# Altium project Portable_Logger_Rev1.0.PrjPcb
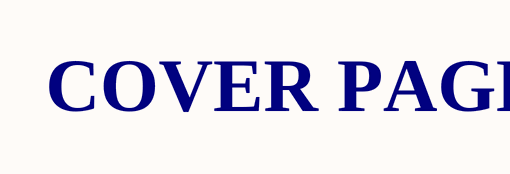
[diagram p0: Cover page - Project Log.SchDoc]
6 sheets, 148 parts. Net scope: flat (ports and power ports of the same name join across sheets).
Board file: Plog_v1.PcbDoc
Sheets:
  Cover page - Project Log.SchDoc
  Block diagram.SchDoc
    Power = 1. Power supply.SchDoc
    MCU = 2. MCU.SchDoc
    GSM = 3.GSM Module.SchDoc
    ADC = 4. ADC.SchDoc

## Sheet Cover page - Project Log.SchDoc
size A

### Notes on the sheet
- COVER PAGE

## Sheet Block diagram.SchDoc
size A
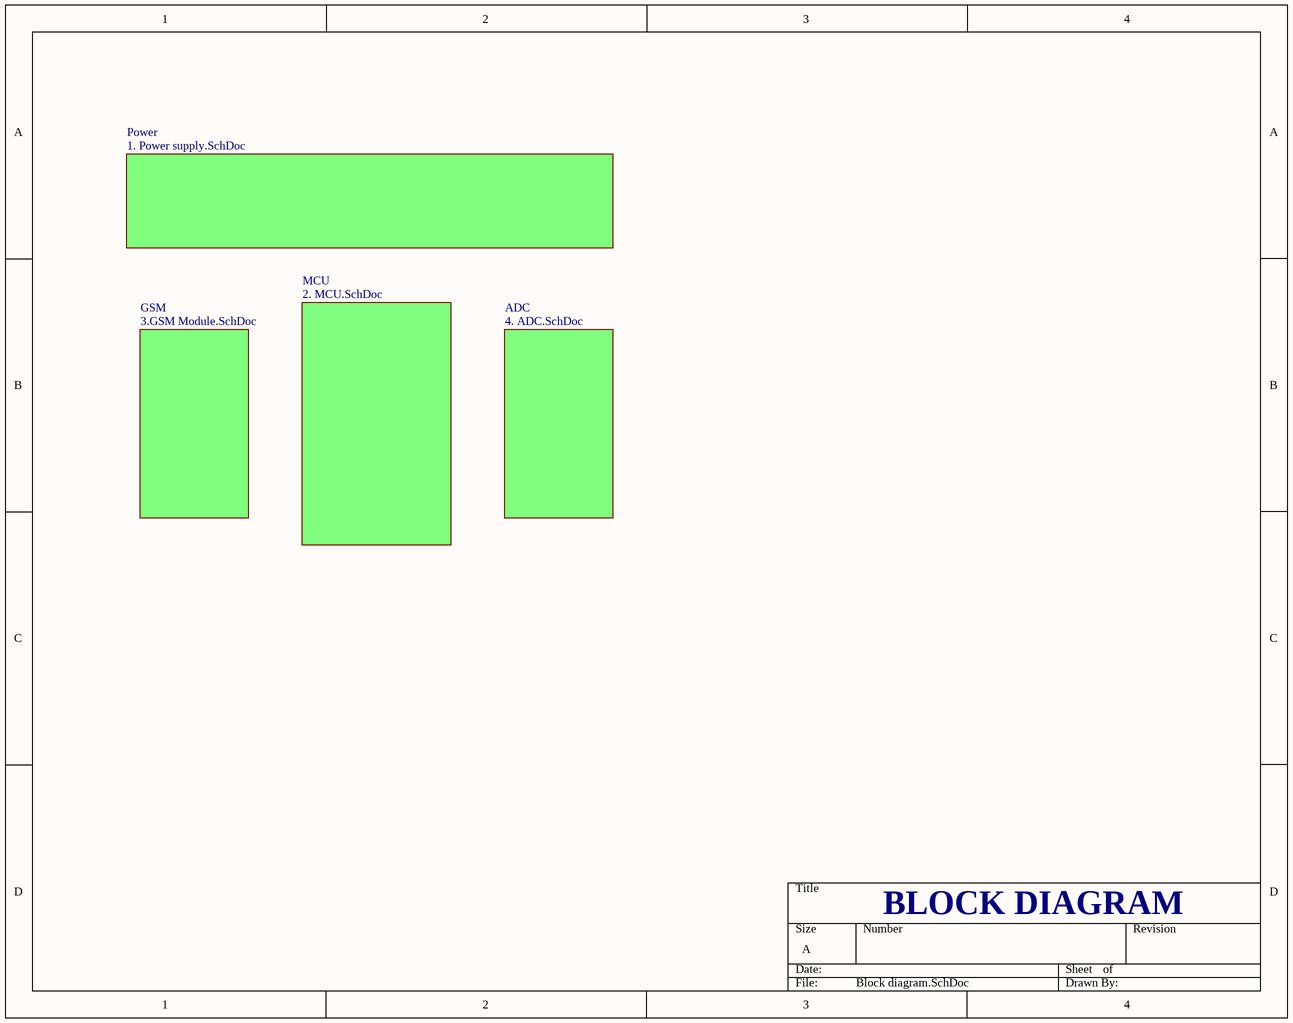
[diagram p1: Block diagram.SchDoc]

### Sub-sheets
ADC = 4. ADC.SchDoc: no entries
GSM = 3.GSM Module.SchDoc: no entries
MCU = 2. MCU.SchDoc: no entries
Power = 1. Power supply.SchDoc: no entries

### Notes on the sheet
- BLOCK DIAGRAM

## Sheet 1. Power supply.SchDoc
size A4
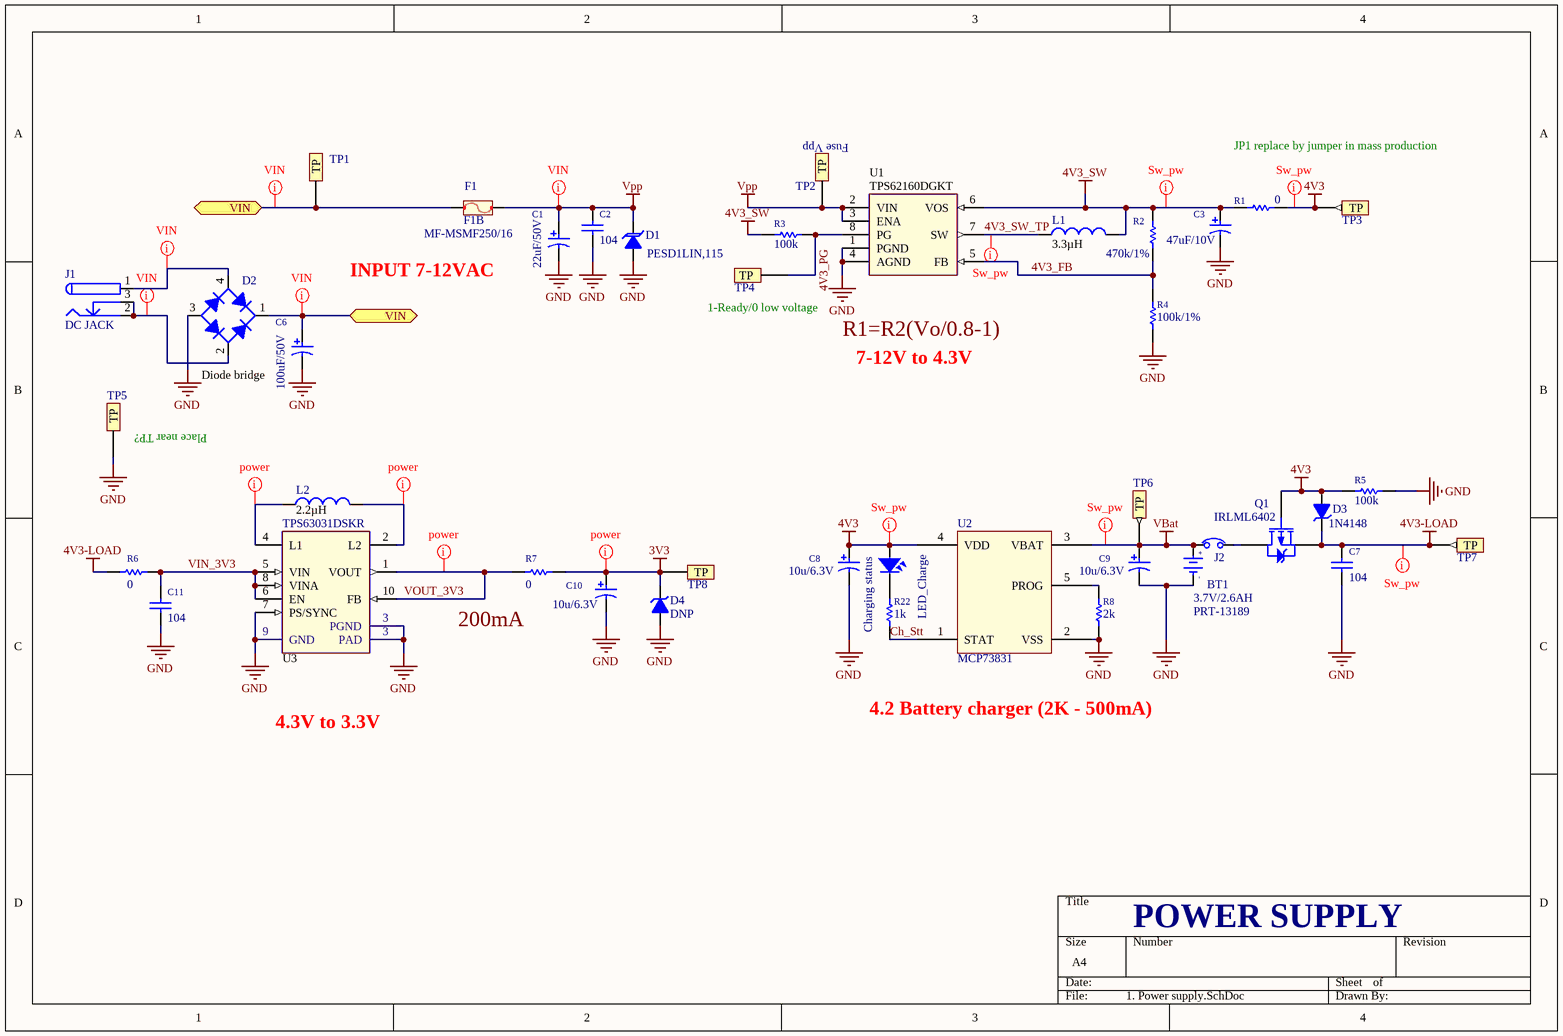
[diagram p2: 1. Power supply.SchDoc]

### Parts
BT1  3.7V/2.6AH  value PRT-13189  [Batterry Cell]
C1  value 22uF/50V  [CAP_SMD_6_3MM_N]  (hidden comment: 22uu/50V)
C2  104  [sm-0603-c]
C3  value 47uF/10V  [Cap SMD Tant - 470u]  (hidden comment: 47uF)
C6  value 100uF/50V  [CAP SMD ALUMINUM G.CAOVANHUONG]  (hidden comment: 22uu/50V)
C7  104  [sm-0603-c]
C8  value 10u/6.3V  [Cap SMD Tant 10u]  (hidden comment: 10u)
C9  value 10u/6.3V  [Cap SMD Tant 10u]  (hidden comment: 10u)
C10  value 10u/6.3V  [Cap SMD Tant 10u]  (hidden comment: 10u)
C11  104  [sm-0603-c]
D1  PESD1LIN,115  [DIODE_SMB]
D2  Diode Bridge  [DB-38R]
D3  1N4148  [DIODE-SOD80]
D4  DNP  [DIODE-SOD80]
F1  F1B  value MF-MSMF250/16  [SMD-PTC]
J1  DC JACK  [DC JACK.CAOVANHUONG]
J2  jumper selector  [CON.HDR1X2]  (value not drawn)
L1  3.3µH  [Inductor 2]
L2  2.2µH  [INDUCTOR 4]
LED_Charge  Charging status  [LED0603]
Q1  IRLML6402  [SOT23-3.CAOVANHUONG]
R1  0  [R2012-0805]
R2  value 470k/1%  [SM-0603-R]  (hidden comment: 470k)
R3  100k  [SM-0603-R]
R4  value 100k/1%  [SM-0603-R]  (hidden comment: 100k)
R5  100k  [SM-0603-R]
R6  0  [R2012-0805]
R7  0  [R2012-0805]
R8  value 2k  [SM-0603-R]  (hidden comment: 100k)
R22  1k  [SM-0603-R]
TP1  Vin  [TP]  (value not drawn)  (no BOM)
TP2  VIN  [TP]  (value not drawn)  (no BOM)
TP3  4V3  [TP]  (value not drawn)  (no BOM)
TP4  4V3_PG  [TP]  (value not drawn)  (no BOM)
TP5  GND  [TP]  (value not drawn)  (no BOM)
TP6  4V3  [TP]  (value not drawn)  (no BOM)
TP7  4V3  [TP]  (value not drawn)  (no BOM)
TP8  TP  [TP]  (value not drawn)  (no BOM)
U1  TPS62160DGKT  [SSOP8.S-PDSO-G8]
U2  MCP73831  [SOT23-5.CAOVANHUONG]
U3  TPS63031DSKR  [WSON10]

### Ports
VIN

### Nets
3V3: C10.1 D4.2(K) R7.2 TP8.1(TP)
4V3: C8.1 D3.1(A) LED_Charge.1 Q1.1(G) R1.2 R5.1 TP3.1(TP) U2.4(VDD)
4V3-LOAD: C7.1 D3.2(K) Q1.2(S) R6.1 TP7.1(TP)
4V3_SW: C3.1 L1.2 R1.1 R2.1 R3.2 U1.6(VOS)
GND: BT1.2(GND) C1.2 C2.2 C3.2 C6.2 C7.2 C8.2 C9.2 C10.2 C11.2 D1.1(A) D2.3(A) D4.1(A) R4.2 R5.2 R8.2 TP5.1(TP) U1.1(PGND) U1.4(AGND) U2.2(VSS) U3.3(PAD) U3.7(PS/SYNC) U3.9(GND)
VBat: BT1.1(+3V) C9.1 J2.1 TP6.1(TP) U2.3(VBAT)
Vpp: C1.1 C2.1 D1.2(K) F1.2 TP2.1(TP) U1.2(VIN) U1.3(ENA)
4V3_FB: R2.2 R4.1 U1.5(FB)
4V3_PG: R3.1 TP4.1(TP) U1.8(PG)
4V3_SW_TP: L1.1 U1.7(SW)
Ch_Stt: R22.1 U2.1(STAT)
VIN_3V3: C11.1 R6.2 U3.5(VIN) U3.6(EN) U3.8(VINA)
VOUT_3V3: R7.1 U3.1(VOUT) U3.10(FB)
NetC6_1: C6.1 D2.1(K) F1.1 TP1.1(TP) ; port VIN
NetD2_2: D2.2(C) J1.2 J1.3
NetD2_4: D2.4(C) J1.1
NetJ2_2: J2.2 Q1.3(D)
NetL2_1: L2.1 U3.4(L1)
NetL2_2: L2.2 U3.2(L2)
NetLED_Charge_2: LED_Charge.2 R22.2
NetR8_1: R8.1 U2.5(PROG)

### Layout directives
rule Width Constraint [Pref Width = 40mil    Min Width = 30mil    Max Width = 50mil]: NetC6_1, NetD2_2, NetD2_4, Vpp
rule Width Constraint [Pref Width = 30mil    Min Width = 10mil    Max Width = 40mil]: 3V3, 4V3, 4V3-LOAD, 4V3_SW, 4V3_SW_TP, NetL2_1, NetL2_2, VBat, VOUT_3V3

### Notes on the sheet
- (near TP2) Fuse Vpp
- JP1 replace by jumper in mass production
- INPUT 7-12VAC
- (near TP4) 1-Ready/0 low voltage
- R1=R2(Vo/0.8-1)
- 7-12V to 4.3V
- (near TP5) Place near TP?
- (near R7) 200mA
- 4.2 Battery charger (2K - 500mA)
- 4.3V to 3.3V
- POWER SUPPLY
- (in symbol PIN 3V) +; -

### Library data of the parts
BT1 = PIN 3V: BATTERY LITHIUM 3.7V 2.6AH; Manufacturer: SparkFun Electronics; Vendor: DIGIKEY; Vendor P/N: 1568-1490-ND; DNP: *; Manufacturer P/N: PRT-13189; Package: 0.72" Dia x 2.56" H; Part: PRT-13189; Price: *
C1 C6 = Cap_Pol: CAP ALUM 22UF 20% 50V SMD; Manufacturer: Panasonic Electronic Components; Manufacturer P/N: EEE-FK1H220P; Part: 22uuF; Vendor: DIGIKEY; Vendor P/N: PCE3811CT-ND; Type: Aluminum Solid/Tantalum Capacitor; Voltage: 50V; Tolerence: 20%
C2 C7 C11 = Capacitor: CAP CER 10000PF 16V 0603; Manufacturer: Taiyo Yuden; Manufacturer P/N: EMK107SD103JA-T; Vendor: DIGIKEY; Vendor P/N: 587-1093-1-ND; Package: 0603; Part: EMK107SD103JA-T; Value: 104; Voltage: 16V
C3 = Cap_Pol: 47uF/10V ±10% SMD Tantalum Capacitor; Manufacturer: AVX; Manufacturer P/N: TAJC476K010RNJ; Voltage: 10V; Type: Aluminum Solid/Tantalum Capacitor; Vendor: www.tme.vn; Vendor P/N: TAJC476K010RNJ; Price: 1600 VND; Part: 47uF; Package: 0603
C8-C10 = Cap_Pol: CAP CER 10UF 6.3V X5R 1206; Manufacturer: Samsung Electro-Mechanics; Manufacturer P/N: CL31A106MQHNNNE; Vendor: DIGIKEY; Vendor P/N: 1276-3045-1-ND; Tollerance: 20%; Voltage: 6.3V; Part: 10u; Package: 1206; DNP: *
D1 = Diode TVS: TVS DIODE 15V/24V 44V/70V SOD323; Manufacturer: Nexperia USA Inc.; Power: 160W; Vendor: DIGIKEY; Vendor P/N: 1727-3818-1-ND; Voltage: 15V; Current: 3A; DNP: *; Manufacturer P/N: PESD1LIN,115; Package: SOD323; Part: PESD1LIN,115; Price: *; Tollerance: *; Value: PESD1LIN,115
D2 = Diode_Bridge: Rectifier Bridge; Vendor: Digikey; Published: 8-Jun-2000; LatestRevisionDate: 17-Jul-2002; LatestRevisionNote: Re-released for DXP Platform.; PackageReference: D-38; ComponentLink1Description: Digikey Part Link; ComponentLink1URL: http://www.irf.com/; ComponentLink2Description: Open Datasheet; ComponentLink2URL: http://www.irf.com/product-info/datasheets/data/1kab-e.pdf; Price: 2000 VND; Date of Price: 19/11/2010; Part: Diode_Bridge; VALUE: Diode bridge
D3 D4 = Diode Zener: Zener Diode; Manufacturer: Unknow; Value: Unknow; DNP: DNP; Manufacturer P/N: Unknow; Package: Unknow; Part: Unknow; Price: Unknow; Vendor: Unknow; Vendor P/N: Unknow; Voltage: Unknow; Current: Unknow
F1 = Fuse: 2.5A/16V SMD-1812 PTC Resettable Fuses; Manufacturer: Bourns Inc.; DNP: *; Manufacturer P/N: MF-MSMF250/16; Package: 1812; Part: MF-MSMF250/16; Vendor: www.tme.vn; Vendor P/N: MF-MSMF250/16; Price: *
J1 = DC JACK: Low Voltage Power Supply Connector; Published: 17-Dec-2003; DatasheetDocument: 09-May-2002; Publisher: Altium Limited; ComponentLink1Description: Manufacturer Link; ComponentLink1URL: http://domino.kycon.com/internet/Products.html
L1 = Inductor: FIXED IND 3.3UH 3.2A 30.2 MOHM; Manufacturer: Bourns Inc.; Manufacturer P/N: SRN6045-3R3Y; Vendor: DIGIKEY; Vendor P/N: SRN6045-3R3YCT-ND; Tollerance: 30%; Part: 3.3µH; Value: 3.3µH; Package: 6.00mm x 6.00mm; Current: 3.2A; Res: 30.2 mOhm
L2 = Inductor: FIXED IND 2.2UH 2.9A 42 MOHM SMD; Manufacturer: Taiyo Yuden; Manufacturer P/N: NRS5020T2R2NMGJ; Vendor: DIGIKEY; Vendor P/N: 587-2405-1-ND; Tollerance: 30%; Res: 42 mOhm; Part: 2.2µH; Value: 2.2µH; Package: 4.90mm x 4.90mm; Current: 2.9A
LED_Charge = LED: LED Single colour Green and Red; Manufacturer: Unknow; Value: LED 3 ly Single Colour; DNP: DNP; Manufacturer P/N: Unknow; Package: Unknow; Part: Unknow; Price: Unknow; Voltage: Unknow; Vendor: Unknow; Vendor P/N: Unknow; Current: Unknow
Q1 = IRLML6402: P-Channel MOSFET, ID =3.7A @ TA = 25°C, VGS @ -4.5V; Published: 8-Jun-2000; LatestRevisionDate: 17-Jul-2002; LatestRevisionNote: Re-released for DXP Platform.; PackageVersion: 1995/1996; PackageReference: E3; Publisher: Altium Limited; PackageDescription: TO, Flat Index; 3 In-Line, Axial Leads; Body Dia. 4.6mm; Lead Dia. 0.5 mm (max)
R1 R6 R7 = Resistor: RES SMD 0 OHM JUMPER 1/10W 0805; Manufacturer: Panasonic Electronic Components; Manufacturer P/N: ERJ-6GEY0R00V; Vendor: DIGIKEY; Vendor P/N: P0.0ACT-ND; Tollerance: 5%; Part: 0; Value: 0; Package: 0805; Power: 1/10W
R2 = Resistor: RES SMD 470K OHM 1% 1/10W 0603; Manufacturer: Panasonic Electronic Components; Manufacturer P/N: ERJ-3EKF4703V; Vendor: DIGIKEY; Vendor P/N: P470KHCT-ND; Tollerance: 1%; Part: 470k; Package: 0603; Power: 1/10W; DNP: *
R3 R5 R8 = Resistor: RES SMD 100K OHM 5% 1/10W 0603; Manufacturer: Panasonic Electronic Components; Manufacturer P/N: ERJ-3GEYJ104V; Vendor: DIGIKEY; Vendor P/N: P100KGCT-ND; Tollerance: 5%; Part: 100k; Package: 0603; Power: 1/10W; DNP: *
  R3 R5: Value: 100k
R4 = Resistor: RES SMD 100K OHM 1% 1/10W 0603; Manufacturer: Panasonic Electronic Components; Manufacturer P/N: ERJ-3EKF1003V; Vendor: DIGIKEY; Vendor P/N: P100KHCT-ND; Tollerance: 1%; Part: 100k; Package: 0603; Power: 1/10W; DNP: *
R22 = Resistor: RES SMD 1K OHM 5% 1/10W 0603; Manufacturer: Panasonic Electronic Components; Manufacturer P/N: ERJ-3GEYJ102V; Vendor: DIGIKEY; Vendor P/N: P1.0KGCT-ND; Tollerance: 5%; Part: 1k; Value: 1k; Package: 0603; Power: 1/10W; DNP: *
TP1-TP8 = TP: Test Point
U1 = TPS62160: IC REG BUCK ADJ 1A SYNC 8VSSOP; Manufacturer: Texas Instruments; Vendor: DIGIKEY; Vendor P/N: 296-30318-1-ND; Value: TPS62160DGKT; Part: TPS62160DGKT; DNP: *; Manufacturer P/N: TPS62160DGKT; Package: VSSOP8
U2 = MCP73831: Miniature Single Cell, Fully Integrated Li-Ion,  Li-Polymer Charge Management ControllerController; Manufacturer: Microchip; Vendor: TME; Vendor P/N: MCP73832T-2ACI/OT; Package: SOT-23-5; Part: MCP73831; Price: 15.000d
U3 = TPS63031: IC REG BUCK BST 3.3V 0.9A 10SON; Manufacturer: Texas Instruments; Vendor: DIGIKEY; Vendor P/N: 296-39461-1-ND; Value: TPS63031DSKR; Part: TPS63031DSKR; DNP: *; Manufacturer P/N: TPS63031DSKR; Package: SON10
J2 = jumper selector: ComponentLink2Description: Open Datasheet; Price: 500 VND; Date of Price: 19/11/2010; Part: jumper selector

## Sheet 2. MCU.SchDoc
size A4
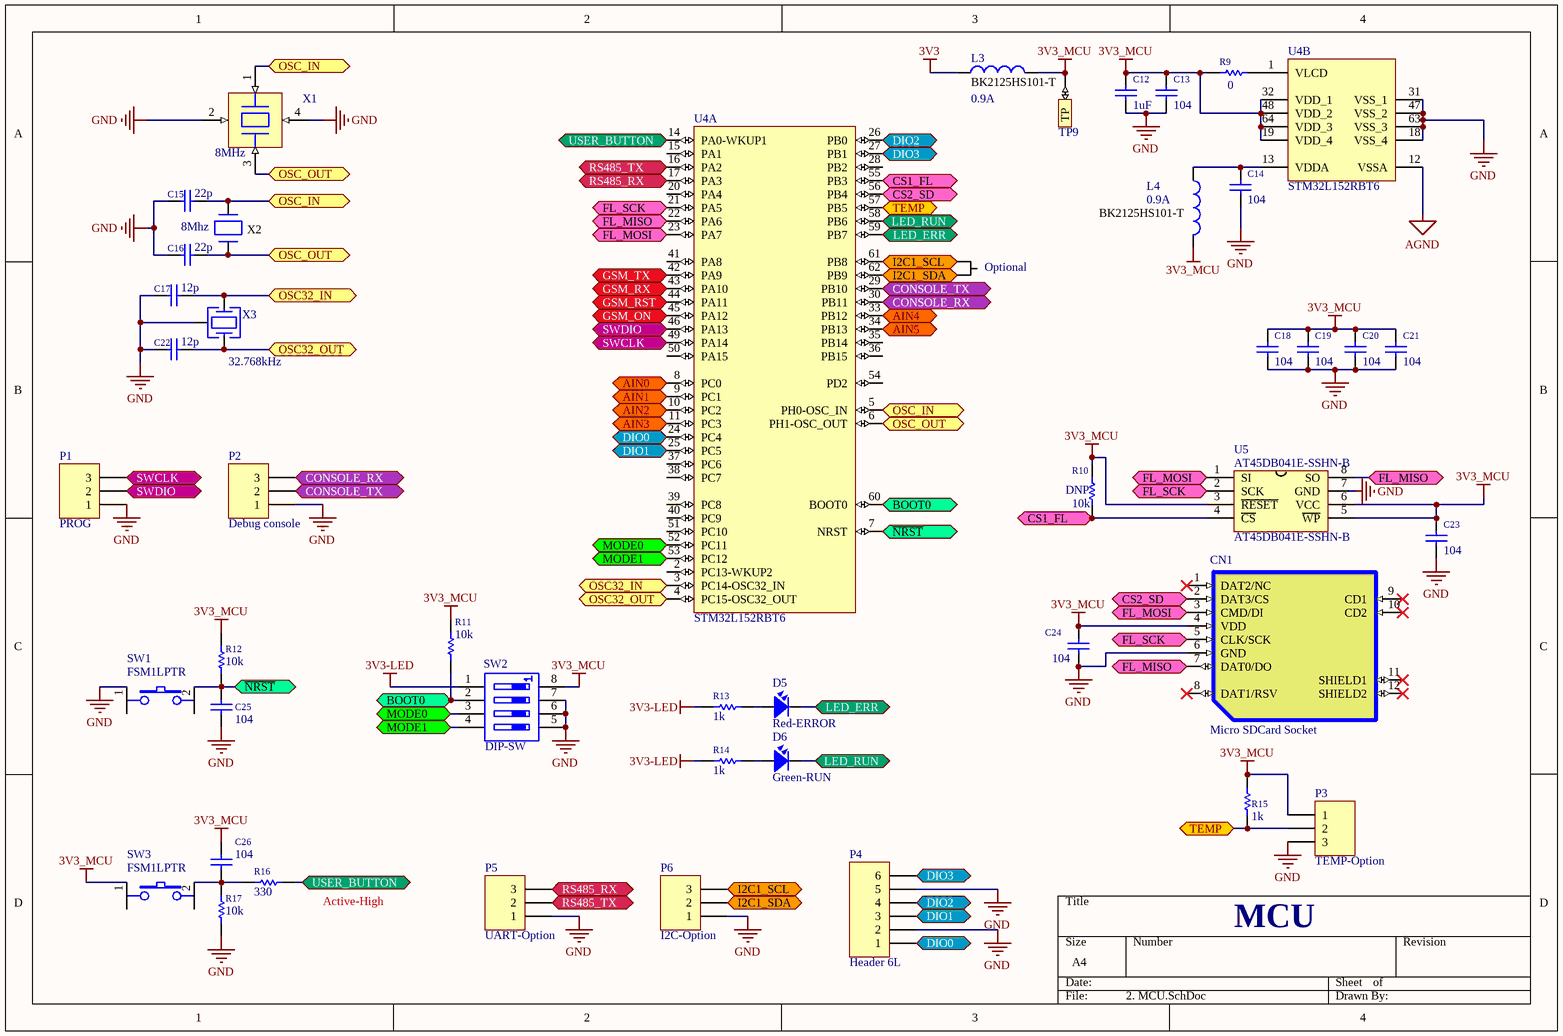
[diagram p3: 2. MCU.SchDoc]

### Parts
C12  value 1uF  [SM-0805 CAP]  (hidden comment: 1u)
C13  104  [sm-0603-c]
C14  104  [sm-0603-c]
C15  22p  [sm-0603-c]
C16  22p  [sm-0603-c]
C17  12p  [sm-0603-c]
C18  104  [sm-0603-c]
C19  104  [sm-0603-c]
C20  104  [sm-0603-c]
C21  104  [sm-0603-c]
C22  12p  [sm-0603-c]
C23  104  [sm-0603-c]
C24  104  [sm-0603-c]
C25  104  [sm-0603-c]
C26  104  [sm-0603-c]
CN1  Micro SDCard Socket  [MicroSD-3]
D5  Red-ERROR  [LED0603]
D6  Green-RUN  [LED0603]
L3  Current: 0.9A  [L2012-0805]  (hidden comment: BK2125HS101-T)
L4  Current: 0.9A  [L2012-0805]  (hidden comment: BK2125HS101-T)
P1  PROG  [HEADER 3PIN.CAOVANHUONG]
P2  Debug console  [HEADER 3PIN.CAOVANHUONG]
P3  TEMP-Option  [HEADER 3PIN.CAOVANHUONG]
P4  Header 6L  [HDR1X6 - L]
P5  UART-Option  [HEADER 3PIN.CAOVANHUONG]
P6  I2C-Option  [HEADER 3PIN.CAOVANHUONG]
R9  value 0  [SM-0603-R]  (hidden comment: 10k)
R10  10k  [SM-0603-R]
R11  10k  [SM-0603-R]
R12  10k  [SM-0603-R]
R13  1k  [SM-0603-R]
R14  1k  [SM-0603-R]
R15  1k  [SM-0603-R]
R16  value 330  [SM-0603-R]  (hidden comment: 10k)
R17  10k  [SM-0603-R]
SW1  FSM1LPTR  [BUTTON-SMD 2PIN.CAOVANHUONG]
SW2  value DIP-SW  [SW-DIP4]  (hidden comment: 208-4)
SW3  FSM1LPTR  [BUTTON-SMD 2PIN.CAOVANHUONG]
TP9  4V3  [TP]  (value not drawn)  (no BOM)
U4  STM32L152RBT6  [LQFP64_N]  (parts A,B of 2)
U5  AT45DB041E-SSHN-B  [SOIC8]
X1  8MHz  [Crystal.ECX-3S]
X2  8Mhz  [Crystal.HC49_N]
X3  32.768kHz  [Crystal cylinder]

### Ports
AIN0, AIN1, AIN2, AIN3, AIN4, AIN5, BOOT0 (bidir), CONSOLE_RX, CONSOLE_TX, CS1_FL, CS2_SD, DIO0, DIO1, DIO2, DIO3, FL_MISO, FL_MOSI, FL_SCK, GSM_ON, GSM_RST, GSM_RX, GSM_TX, I2C1_SCL, I2C1_SDA, LED_ERR, LED_RUN, MODE0, MODE1, OSC32_IN, OSC32_OUT, OSC_IN, OSC_OUT, RS485_RX, RS485_TX, SWCLK, SWDIO, TEMP, USER_BUTTON, ~{NRST}

### Nets
3V3: L3.1
3V3-LED: R13.2 R14.2 SW2.1(A1)
3V3_MCU: C12.1 C13.1 C18.1 C19.1 C20.1 C21.1 C23.1 C24.1 C26.2 CN1.4(VDD) L3.2 L4.2 P3.1 R9.2 R10.2 R11.2 R12.2 R15.1 SW2.8(B1) SW3.1 TP9.1(TP) U4.19(VDD_4) U4.32(VDD_1) U4.48(VDD_2) U4.64(VDD_3) U5.3(~{RESET}) U5.5(~{WP}) U5.6(VCC)
AGND: U4.12(VSSA)
GND: C12.2 C13.2 C14.2 C15.1 C16.1 C17.1 C18.2 C19.2 C20.2 C21.2 C22.1 C23.2 C24.2 C25.2 CN1.6(GND) P1.1 P2.1 P3.3 P4.2 P4.5 P5.1 P6.1 R17.1 SW1.1 SW2.5(B4) SW2.6(B3) SW2.7(B2) U4.18(VSS_4) U4.31(VSS_1) U4.47(VSS_2) U4.63(VSS_3) U5.7(GND) X1.2 X1.4 X3.3(GND)
GSM_ON: U4.45(PA12) ; port GSM_ON
GSM_RST: U4.44(PA11) ; port GSM_RST
NetC14_1: C14.1 L4.1 U4.13(VDDA)
NetC15_2: C15.2 U4.5(PH0-OSC_IN) X1.1 X2.1 ; port OSC_IN
NetC16_2: C16.2 U4.6(PH1-OSC_OUT) X1.3 X2.2 ; port OSC_OUT
NetC17_2: C17.2 U4.3(PC14-OSC32_IN) X3.1 ; port OSC32_IN
NetC22_2: C22.2 U4.4(PC15-OSC32_OUT) X3.2 ; port OSC32_OUT
NetC25_1: C25.1 R12.1 SW1.2 U4.7(NRST) ; port ~{NRST}
NetC26_1: C26.1 R16.2 R17.2 SW3.2
NetCN1_2: CN1.2(DAT3/CS) U4.56(PB4) ; port CS2_SD
NetCN1_3: CN1.3(CMD/DI) U4.23(PA7) U5.1(SI) ; port FL_MOSI
NetCN1_5: CN1.5(CLK/SCK) U4.21(PA5) U5.2(SCK) ; port FL_SCK
NetCN1_7: CN1.7(DAT0/DO) U4.22(PA6) U5.8(SO) ; port FL_MISO
NetD5_1: D5.1 R13.1
NetD5_2: D5.2 U4.59(PB7) ; port LED_ERR
NetD6_1: D6.1 R14.1
NetD6_2: D6.2 U4.58(PB6) ; port LED_RUN
NetD7_2: U4.8(PC0) ; port AIN0
NetD8_2: U4.11(PC3) ; port AIN3
NetD9_2: U4.9(PC1) ; port AIN1
NetD10_2: U4.10(PC2) ; port AIN2
NetP1_2: P1.2 U4.46(PA13) ; port SWDIO
NetP1_3: P1.3 U4.49(PA14) ; port SWCLK
NetP2_2: P2.2 U4.29(PB10) ; port CONSOLE_TX
NetP2_3: P2.3 U4.30(PB11) ; port CONSOLE_RX
NetP3_2: P3.2 R15.2 U4.57(PB5) ; port TEMP
NetP4_1: P4.1 U4.24(PC4) ; port DIO0
NetP4_3: P4.3 U4.25(PC5) ; port DIO1
NetP4_4: P4.4 U4.26(PB0) ; port DIO2
NetP4_6: P4.6 U4.27(PB1) ; port DIO3
NetP5_2: P5.2 U4.16(PA2) ; port RS485_TX
NetP5_3: P5.3 U4.17(PA3) ; port RS485_RX
NetP6_2: P6.2 U4.62(PB9) ; port I2C1_SDA
NetP6_3: P6.3 U4.61(PB8) ; port I2C1_SCL
NetR9_1: R9.1 U4.1(VLCD)
NetR10_1: R10.1 U4.55(PB3) U5.4(~{CS}) ; port CS1_FL
NetR11_1: R11.1 SW2.2(A2) U4.60(BOOT0) ; port BOOT0
NetR16_1: R16.1 U4.14(PA0-WKUP1) ; port USER_BUTTON
NetR19_2: U4.43(PA10) ; port GSM_RX
NetR20_2: U4.42(PA9) ; port GSM_TX
NetR29_2: U4.33(PB12) ; port AIN4
NetSW2_3: SW2.3(A3) U4.52(PC11) ; port MODE0
NetSW2_4: SW2.4(A4) U4.53(PC12) ; port MODE1
NetU4_34: U4.34(PB13) ; port AIN5

Not connected (* = marked no-connect by the designer): CN1 1(DAT2/NC)* 8(DAT1/RSV)* 9(CD1)* 10(CD2)* 11(SHIELD1)* 12(SHIELD2)*; U4 2(PC13-WKUP2) 15(PA1) 20(PA4) 28(PB2) 35(PB14) 36(PB15) 37(PC6) 38(PC7) 39(PC8) 40(PC9) 41(PA8) 50(PA15) 51(PC10) 54(PD2)

### Notes on the sheet
- Optional
- (near R16) Active-High
- MCU

### Library data of the parts
C12 = Capacitor: CAP CER 1UF 16V X7R 0805; Manufacturer: KEMET; Manufacturer P/N: C0805C105J4RAC7025; Vendor: DIGIKEY; Vendor P/N: 399-7342-1-N; Tollerance: 5%; Voltage: 16V; Part: 1u; Package: 0805; Power: *; DNP: *
C13 C14 C18-C21 C23-C26 = Capacitor: as C2 on sheet 1. Power supply; Package: 0603; Part: EMK107SD103JA-T; Value: 104; Voltage: 16V
C15 C16 = Capacitor: CAP CER 22PF 25V C0G/NP0 0603; Manufacturer: KEMET; Manufacturer P/N: C0603C220J3GACAUTO; Vendor: DIGIKEY; Vendor P/N: 399-6864-1-ND; Tollerance: 1%; Voltage: 25V; Part: 22p; Value: 22p; Package: 0603
C17 C22 = Capacitor: CAP CER 12PF 25V C0G/NP0 0201; Manufacturer: KEMET; Manufacturer P/N: CBR02C120F3GAC; Vendor: DIGIKEY; Vendor P/N: 399-8604-1-ND; Tollerance: 1%; Voltage: 25V; Part: 12p; Value: 12p; Package: 0603
CN1 = MicroSDCard Socket: ComponentLink2Description: Open DataSheet; ComponentLink2URL: H:\LIBRARY\LIBRARY.Datasheet\; Date of Price: 19/11/2010; Price: 5000 VND
D5 D6 = LED: as LED_Charge on sheet 1. Power supply; DNP: DNP; Manufacturer P/N: Unknow; Package: Unknow; Part: Unknow; Price: Unknow; Voltage: Unknow; Vendor: Unknow; Vendor P/N: Unknow; Current: Unknow
L3 L4 = Inductor: FERRITE BEAD 100 OHM 0805 1LN; Manufacturer: Taiyo Yuden; Vendor: DIGIKEY; Vendor P/N: 587-1903-1-ND; Res: 100 OHM; Value: BK2125HS101-T; DNP: *; Manufacturer P/N: BK2125HS101-T; Package: 0805; Part: BK2125HS101-T; Price: *
P1-P3 P5 P6 = Header 3: Header, 3-Pin; LatestRevisionDate: 17-Jul-2002; LatestRevisionNote: Re-released for DXP Platform.; Publisher: Altium Limited
P4 = Header 6L: Header, 6-Pin; LatestRevisionDate: 17-Jul-2002; LatestRevisionNote: Re-released for DXP Platform.; Publisher: Altium Limited
R9-R12 R16 R17 = Resistor: RES SMD 10K OHM 5% 1/10W 0603; Manufacturer: Panasonic Electronic Components; Manufacturer P/N: ERJ-3GEYJ103V; Vendor: DIGIKEY; Vendor P/N: P10KGCT-ND; Tollerance: 5%; Part: 10k; Package: 0603; Power: 1/10W
  R9 R16: DNP: *
  R10: Value: 10k; DNP: DNP
  R11 R12 R17: Value: 10k; DNP: *
R13-R15 = Resistor: as R22 on sheet 1. Power supply; Tollerance: 5%; Part: 1k; Value: 1k; Package: 0603; Power: 1/10W; DNP: *
SW1 SW3 = SW PUSHBUTTON-SPST-2/SM: SWITCH TACTILE SPST-NO 0.05A 24V; Manufacturer: TE Connectivity ALCOSWITCH Switches; Vendor: DIGIKEY; Vendor P/N: 450-1756-1-ND; Manufacturer P/N: FSM1LPTR; Part: SW TACT-SPST-2; Value: FSM1LPTR; DNP: *; Package: 6mmx6mmx3.1mm
SW2 = SWDIP-4: SWITCH SLIDE DIP SPST 50MA 24V; Manufacturer: CTS Electrocomponents; Vendor: DIGIKEY; Vendor P/N: CT2084-ND; Manufacturer P/N: 208-4; Package: *; DNP: *; Part: 208-4; Price: *
TP9 = TP: Test Point
U4 = STM32L152RBT6: ARM Cortex-M3 32-bit MCU, 128 KB Flash, 16 KB Internal RAM, 51 I/Os, 64-pin LQFP, -40 to 85 degC, Tray; Manufacturer: STMicroelectronics; D/A Converter: 2x12-bit (2 Channel); Data E2PROM nom (B): 4096; FLASH Size (Prog) (kB): 128; I/Os (High Current): 51; Internal RAM Size (kB): 16; Operating Frequency(F) (Processor speed) (MHz): 32; Supply Voltage(Vcc) min (V): 1.65; DatasheetVersion: Rev. 8; PackageVersion: Rev. 4, 06/2013; PackageReference: LQFP64; PackageDescription: 64-Pin Low Profile Quad Flat Package, 10 x 10 mm Body, 0.5 mm Pitch; Core: ARM Cortex-M3; Packing: Tray; Mounting Technology: Surface Mount; PartNumber: STM32L152RBT6; ComponentLink1Description: Manufacturer URL; ComponentLink1URL: http://www.st.com/web/en/home.html; ComponentLink2Description: Datasheet; ComponentLink2URL: http://www.st.com/st-web-ui/static/active/en/resource/technical/document/datasheet/CD00277537.pdf; ComponentLink3Description: Package Specification; ComponentLink3URL: http://www.st.com/st-web-ui/static/active/en/resource/technical/document/datasheet/DM00037051.pdf
U5 = AT45DB011: IC FLASH 4MBIT 85MHZ 8SOIC; Manufacturer: Adesto Technologies; Vendor: DIGIKEY; Vendor P/N: 1265-1067-5-ND; Part: AT45DB041E-SSHN-B; Value: AT45DB041E-SSHN-B; Manufacturer P/N: AT45DB041E-SSHN-B; Package: SOIC8; Tollerance: *
X1 = Crystal SMD: CRYSTAL 8.0000MHZ 18PF SMD; Manufacturer: Diodes Incorporated; Manufacturer P/N: FY0800027; Vendor: DIGIKEY; Vendor P/N: FY0800027CT-ND; Tollerance: ±20ppm; Part: 8MHz; Value: 8MHz; Package: 5.00mm x 3.20mm; Load Capacitance: 18pF
X2 = Crystal: CRYSTAL 8.0000MHZ 18PF TH; Manufacturer: Taiwan; Manufacturer P/N: HC-49S; Vendor: TME; Tollerance: ±30ppm; Vendor P/N: HC-49S; Part: 8Mhz; Value: 8Mhz; Package: 11.05x4.65x3.7mm; Load Capacitance: 18pF
X3 = Crystal Cylinder: CRYSTAL 32.7680KHZ 12.5PF SMD; Manufacturer: ECS Inc.; Manufacturer P/N: ECS-.327-12.5-13FLX-C; Vendor: DIGIKEY; Vendor P/N: XC1911CT-ND; Tollerance: ±10ppm; Value: 32.768kHz; Package: 2.00mm x 6.10mm; Part: 32.768kHz; DNP: *; Load Capacitance: 12.5pF

## Sheet 3.GSM Module.SchDoc
size A4
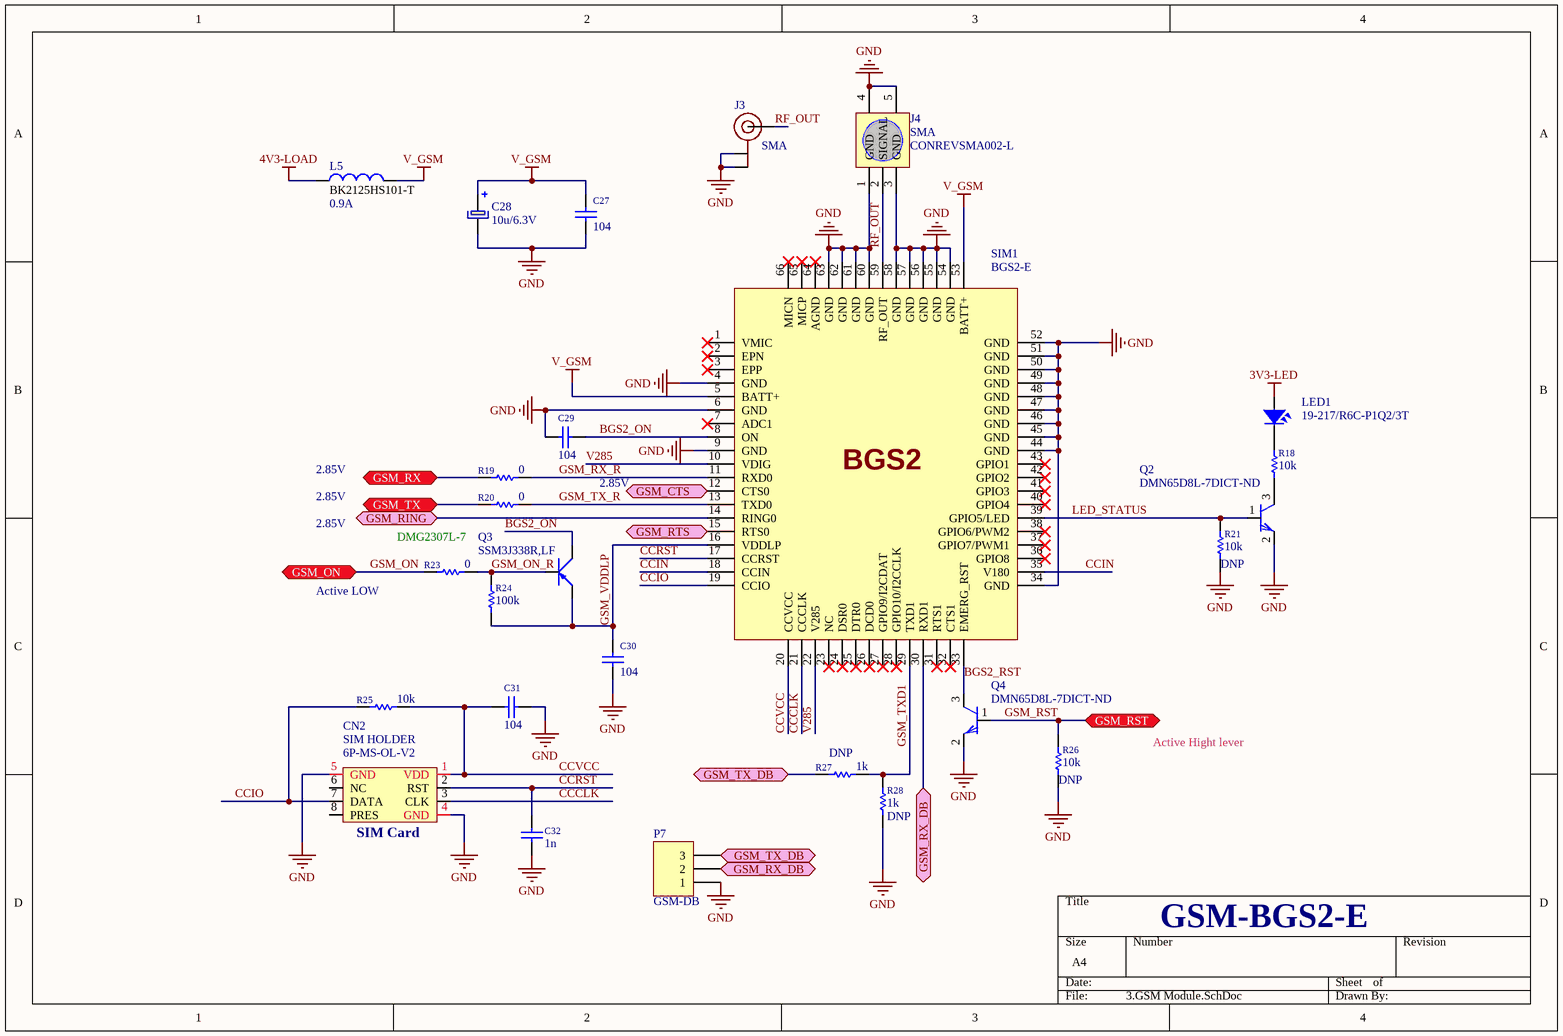
[diagram p4: 3.GSM Module.SchDoc]

### Parts
C27  104  [sm-0603-c]
C28  value 10u/6.3V  [Tantalum Case A]  (hidden comment: 10u)
C29  104  [sm-0603-c]
C30  104  [sm-0603-c]
C31  104  [sm-0603-c]
C32  1n  [sm-0603-c]
CN2  SIM HOLDER  value 6P-MS-OL-V2  [Sim card holder 1]
J3  SMA  [U.FL]
J4  SMA  value CONREVSMA002-L  [SMA - through hole]
L5  Current: 0.9A  [L2012-0805]  (hidden comment: BK2125HS101-T)
LED1  19-217/R6C-P1Q2/3T  [LED0603]
P7  GSM-DB  [HEADER 3PIN.CAOVANHUONG]
Q2  DMN65D8L-7DICT-ND  [SOT23N]
Q3  SSM3J338R,LF  [SOT23B]
Q4  DMN65D8L-7DICT-ND  [SOT23N]
R18  10k  [SM-0603-R]
R19  0  [SM-0603-R]
R20  0  [SM-0603-R]
R21  10k  [SM-0603-R]
R23  0  [SM-0603-R]
R24  100k  [SM-0603-R]
R25  10k  [SM-0603-R]
R26  10k  [SM-0603-R]
R27  1k  [SM-0603-R]
R28  1k  [SM-0603-R]
SIM1  BGS2-E  [BGS2]

### Ports
GSM_CTS, GSM_ON, GSM_RING, GSM_RST, GSM_RTS, GSM_RX, GSM_RX_DB, GSM_TX, GSM_TX_DB

### Nets
3V3-LED: LED1.1
4V3-LOAD: L5.1
GND: C27.2 C28.2 C29.1 C30.2 C31.2 C32.2 CN2.4(GND) CN2.5(GND) J3.P$1(GND@0) J3.P$2(GND@1) J4.1(GND) J4.3(GND) J4.4 J4.5 P7.1 Q2.2(E) Q4.2(E) R21.1 R26.1 R28.1 SIM1.4(GND) SIM1.6(GND) SIM1.9(GND) SIM1.34(GND) SIM1.44(GND) SIM1.45(GND) SIM1.46(GND) SIM1.47(GND) SIM1.48(GND) SIM1.49(GND) SIM1.50(GND) SIM1.51(GND) SIM1.52(GND) SIM1.54(GND) SIM1.55(GND) SIM1.56(GND) SIM1.57(GND) SIM1.58(GND) SIM1.60(GND) SIM1.61(GND) SIM1.62(GND) SIM1.63(GND)
V_GSM: C27.1 C28.1 L5.2 SIM1.5(BATT+) SIM1.53(BATT+)
BGS2_ON: C29.2 Q3.2(C) SIM1.8(ON)
BGS2_RST: Q4.3(C) SIM1.33(EMERG_RST)
CCCLK: CN2.3(CLK) SIM1.21(CCCLK)
CCIN: SIM1.18(CCIN) SIM1.35(V180)
CCIO: CN2.7(DATA) R25.1 SIM1.19(CCIO)
CCRST: C32.1 CN2.2(RST) SIM1.17(CCRST)
CCVCC: C31.1 CN2.1(VDD) R25.2 SIM1.20(CCVCC)
GSM_ON: R23.2 ; port GSM_ON
GSM_ON_R: Q3.3(B) R23.1 R24.2
GSM_RST: Q4.1(B) R26.2 ; port GSM_RST
GSM_RX_R: R19.1 SIM1.11(RXD0)
GSM_TX_R: R20.1 SIM1.13(TXD0)
GSM_TXD1: R27.2 R28.2 SIM1.29(TXD1)
GSM_VDDLP: C30.1 Q3.1(E) R24.1 SIM1.16(VDDLP)
LED_STATUS: Q2.1(B) R21.2 SIM1.39(GPIO5/LED)
RF_OUT: J3.P$3(SIGNAL) J4.2(SIGNAL) SIM1.59(RF_OUT)
V285: SIM1.10(VDIG) SIM1.22(V285)
NetLED1_2: LED1.2 R18.2
NetP7_2: P7.2 SIM1.30(RXD1) ; port GSM_RX_DB
NetP7_3: P7.3 R27.1 ; port GSM_TX_DB
NetQ2_3: Q2.3(C) R18.1
NetR19_2: R19.2 ; port GSM_RX
NetR20_2: R20.2 ; port GSM_TX
NetSIM1_12: SIM1.12(CTS0) ; port GSM_CTS
NetSIM1_14: SIM1.14(RING0) ; port GSM_RING
NetSIM1_15: SIM1.15(RTS0) ; port GSM_RTS

Not connected (* = marked no-connect by the designer): CN2 6(NC) 8(PRES); SIM1 1(VMIC)* 2(EPN)* 3(EPP)* 7(ADC1)* 23(NC)* 24(DSR0)* 25(DTR0)* 26(DCD0)* 27(GPIO9/I2CDAT)* 28(GPIO10/I2CCLK)* 31(RTS1)* 32(CTS1)* 36(GPIO8)* 37(GPIO7/PWM1)* 38(GPIO6/PWM2)* 40(GPIO4)* 41(GPIO3)* 42(GPIO2)* 43(GPIO1)* 64(AGND)* 65(MICP)* 66(MICN)*

### Notes on the sheet
- 2.85V
- DMG2307L-7
- Active LOW
- Active Hight lever
- GSM-BGS2-E
- (in symbol Sim Card Holder) SIM Card

### Library data of the parts
C27 C29-C31 = Capacitor: as C2 on sheet 1. Power supply; Package: 0603; Part: EMK107SD103JA-T; Value: 104; Voltage: 16V
C28 = Capacitor elec: CAP CER 10UF 6.3V X5R 1206; Manufacturer: Samsung Electro-Mechanics; Manufacturer P/N: CL31A106MQHNNNE; Tollerance: 10%; Vendor: DIGIKEY; Vendor P/N: 1276-3045-1-ND; DNP: *; Package: 1206; Part: 10u; Price: *; Voltage: 6.3V
C32 = Capacitor: CAP CER 1000PF 50V X7R 0603; Manufacturer: KEMET; Manufacturer P/N: C0603C102K5RACTU; Vendor: DIGIKEY; Vendor P/N: 399-1082-1-ND; Voltage: 16V; Tollerance: 10%; Part: 1n; Value: 1n; Package: 0603
CN2 = Sim Card Holder: Micro SIM Card Socket 6pin, Open-Lock; Manufacturer: UNKNOW; Vendor: http://thegioiic.com; Manufacturer P/N: 6P-MS-OL-V2; Package: CONN_6P; Part: 6P-MS-OL-V2; Vendor P/N: 6P-MS-OL-V2; DNP: *
J3 = U.FL: PROD_ID: CONN-09193; SF_ID: WRL-09144
J4 = SMA RF Connector: CONN RP-SMA RCPT R/A 50 OHM PCB; Manufacturer: Linx Technologies Inc.; Vendor: DIGIKEY; Vendor P/N: CONREVSMA002-L-ND; DNP: *; Manufacturer P/N: CONREVSMA002-L; Package: RP-SMA; Part: CONREVSMA002-L; Price: *
L5 = Inductor: as L3 on sheet 2. MCU; Value: BK2125HS101-T; DNP: *; Manufacturer P/N: BK2125HS101-T; Package: 0805; Part: BK2125HS101-T; Price: *
LED1 = LED: LED Red Water Clear SMD-0603; Manufacturer: Everlight; Value: 19-217/R6C-P1Q2/3T; DNP: *; Manufacturer P/N: 19-217/R6C-P1Q2/3T; Package: 0603; Part: 19-217/R6C-P1Q2/3T; Vendor: www.tme.vn; Vendor P/N: 19-217/R6C-P1Q2/3T
P7 = Header 3: Header, 3-Pin; LatestRevisionDate: 17-Jul-2002; LatestRevisionNote: Re-released for DXP Platform.; Publisher: Altium Limited
Q2 Q4 = C1815: MOSFET N-CH 60V 310MA SOT23; Manufacturer: Diodes Incorporated; Vendor: DIGIKEY; Manufacturer P/N: DMN65D8L-7DICT-ND; Vendor P/N: DMN65D8L-7DICT-ND; Part: DMN65D8L-7DICT-ND; Value: DMN65D8L-7DICT-ND; Voltage: 60V; Current: 310mA; Package: SOT23
Q3 = A1015: MOSFET P-CH 12V 6A SOT23F; Manufacturer: Toshiba Semiconductor and Storage; Vendor: DIGIKEY; Vendor P/N: SSM3J338RLFCT-ND; Value: SSM3J338R,LF; DNP: *; Manufacturer P/N: SSM3J338R,LF; Package: SOT23F; Part: SSM3J338R,LF; Price: *; Voltage: 12V; Current: 6A
R18 R21 R25 R26 = Resistor: as R9 on sheet 2. MCU; Tollerance: 5%; Part: 10k; Value: 10k; Package: 0603; Power: 1/10W
  R18 R25: DNP: *
  R21 R26: DNP: DNP
R19 R20 R23 = Resistor: RES SMD 0 OHM JUMPER 1/10W 0603; Manufacturer: Panasonic Electronic Components; Manufacturer P/N: ERJ-3GEY0R00V; Vendor: DIGIKEY; Vendor P/N: P0.0GCT-ND; Tollerance: 5%; Part: 0; Value: 0; Package: 0603; Power: 1/10W
R24 = Resistor: as R3 on sheet 1. Power supply; Tollerance: 5%; Part: 100k; Value: 100k; Package: 0603; Power: 1/10W; DNP: *
R27 R28 = Resistor: as R22 on sheet 1. Power supply; Tollerance: 5%; Part: 1k; Value: 1k; Package: 0603; Power: 1/10W; DNP: DNP
SIM1 = BGS2: GSM MODULE 2.5G; Manufacturer: Cinterion - Gemalto; Vendor: rpc.vn; DNP: *; Manufacturer P/N: BGS2-E; Package: MD_BGS2-E; Part: BGS2-E; Power: *; Price: *; Vendor P/N: BGS2-E

## Sheet 4. ADC.SchDoc
size A4
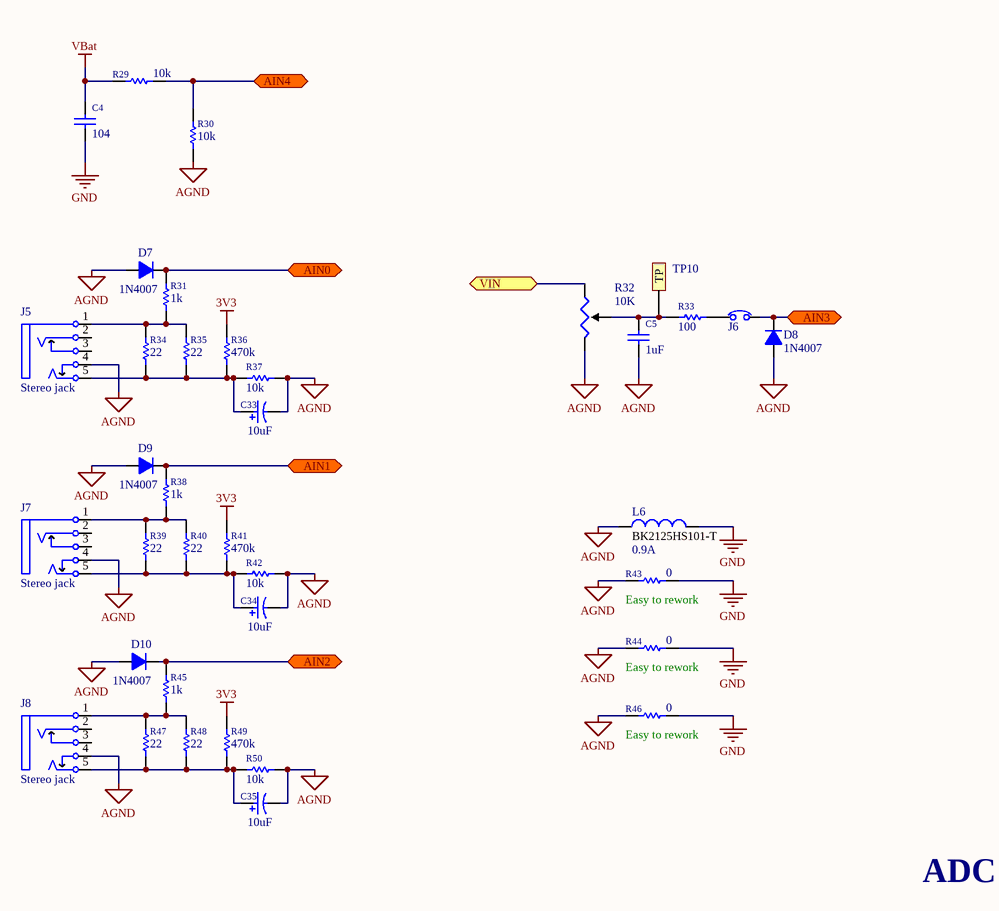
[diagram p5: 4. ADC.SchDoc]

### Parts
C4  104  [sm-0603-c]
C5  value 1uF  [sm-0603-c]  (hidden comment: 104)
C33  value 10uF  [Cap SMD Tant 10u]  (hidden comment: 10u)
C34  value 10uF  [Cap SMD Tant 10u]  (hidden comment: 10u)
C35  value 10uF  [Cap SMD Tant 10u]  (hidden comment: 10u)
D7  1N4007  [SOD-123]
D8  1N4007  [SOD-123]
D9  1N4007  [SOD-123]
D10  1N4007  [SOD-123]
J5  Stereo jack  [Audio Stereo Jack]
J6  jumper selector  [CON.HDR1X2]  (value not drawn)
J7  Stereo jack  [Audio Stereo Jack]
J8  Stereo jack  [Audio Stereo Jack]
L6  Current: 0.9A  [L2012-0805]  (hidden comment: BK2125HS101-T)
R29  10k  [SM-0603-R]
R30  10k  [SM-0603-R]
R31  value 1k  [SM-0603-R]  (hidden comment: 10k)
R32  value 10K  [TRIM Rect]  (hidden comment: Trimmer)
R33  value 100  [SM-0603-R]  (hidden comment: 470k)
R34  value 22  [SM-RES-1206]  (hidden comment: 10k)
R35  22  [SM-0603-R]
R36  value 470k  [SM-0603-R]  (hidden comment: 10k)
R37  value 10k  [SM-0603-R]  (hidden comment: 470k)
R38  value 1k  [SM-0603-R]  (hidden comment: 10k)
R39  value 22  [SM-RES-1206]  (hidden comment: 10k)
R40  22  [SM-0603-R]
R41  value 470k  [SM-0603-R]  (hidden comment: 10k)
R42  value 10k  [SM-0603-R]  (hidden comment: 470k)
R43  0  [R2012-0805]
R44  0  [R2012-0805]
R45  value 1k  [SM-0603-R]  (hidden comment: 10k)
R46  0  [R2012-0805]
R47  value 22  [SM-RES-1206]  (hidden comment: 10k)
R48  22  [SM-0603-R]
R49  value 470k  [SM-0603-R]  (hidden comment: 10k)
R50  value 10k  [SM-0603-R]  (hidden comment: 470k)
TP10  4V3_PG  [TP]  (value not drawn)  (no BOM)

### Ports
AIN0, AIN1, AIN2, AIN3, AIN4, VIN

### Nets
3V3: R36.2 R41.2 R49.2
AGND: C5.2 C33.2 C34.2 C35.2 D7.1(A) D8.1(A) D9.1(A) D10.1(A) J5.4(R2) J7.4(R2) J8.4(R2) L6.1 R30.1 R32.3 R37.1 R42.1 R43.1 R44.1 R46.1 R50.1
GND: C4.2 L6.2 R43.2 R44.2 R46.2
VBat: C4.1 R29.1
NetC5_1: C5.1 R32.2 R33.2 TP10.1(TP)
NetC6_1: R32.1 ; port VIN
NetC33_1: C33.1 J5.5(S2) R34.1 R35.1 R36.1 R37.2
NetC34_1: C34.1 J7.5(S2) R39.1 R40.1 R41.1 R42.2
NetC35_1: C35.1 J8.5(S2) R47.1 R48.1 R49.1 R50.2
NetD7_2: D7.2(K) R31.2 ; port AIN0
NetD8_2: D8.2(K) J6.2 ; port AIN3
NetD9_2: D9.2(K) R38.2 ; port AIN1
NetD10_2: D10.2(K) R45.2 ; port AIN2
NetJ5_1: J5.1(GND) R31.1 R34.2 R35.2
NetJ6_1: J6.1 R33.1
NetJ7_1: J7.1(GND) R38.1 R39.2 R40.2
NetJ8_1: J8.1(GND) R45.1 R47.2 R48.2
NetR29_2: R29.2 R30.2 ; port AIN4

Not connected (* = marked no-connect by the designer): J5 2(S1) 3(R1); J7 2(S1) 3(R1); J8 2(S1) 3(R1)

### Notes on the sheet
- (near R43) Easy to rework
- (near R44) Easy to rework
- (near R46) Easy to rework
- ADC

### Library data of the parts
C4 C5 = Capacitor: as C2 on sheet 1. Power supply; Package: 0603; Part: EMK107SD103JA-T; Voltage: 16V
  C4: Value: 104
C33-C35 = Cap_Pol: as C8 on sheet 1. Power supply; Voltage: 6.3V; Part: 10u; Package: 1206; DNP: *
D7-D10 = Diode 1N4007: DIODE 100V/1A; Manufacturer: TOSHIBA; Vendor P/N: 1N4007-M7; Voltage: 100V; Current: 1A; Vendor: www.tme.vn; Value: 1N4007; Price: 500 VND; Part: Diode 1N4007; Manufacturer P/N: 1N4007-M7; Package: DO-214AC; DNP: *
J5 J7 J8 = Audio Jack: Stereo audio jack
L6 = Inductor: as L3 on sheet 2. MCU; Value: BK2125HS101-T; DNP: *; Manufacturer P/N: BK2125HS101-T; Package: 0805; Part: BK2125HS101-T; Price: *
R29-R31 R33-R42 R45 R47-R50 = Resistor: as R9 on sheet 2. MCU; Tollerance: 5%; Part: 10k; Package: 0603; Power: 1/10W; DNP: *
  R29 R30: Value: 10k
  R35 R40 R48: Value: 22
R32 = Trimmer: Res var, Rectangle Trimmer; Vendor: Nhat Tao - IC Thuan; Published: 8-Jun-2000; LatestRevisionDate: 04-Mar-2005; LatestRevisionNote: PCB Footprint replaced.; PackageReference: J1-0603; ComponentLink1Description: Digikey Part Link; ComponentLink2Description: Open Datasheet; ComponentLink2URL: H:\LIBRARY\LIBRARY.Datasheet\; Price: 2000 VND; Date of Price: 19/11/2010; Part: Trimmer
R43 R44 R46 = Resistor: as R1 on sheet 1. Power supply; Part: 0; Value: 0; Package: 0805; Power: 1/10W
TP10 = TP: Test Point
J6 = jumper selector: ComponentLink2Description: Open Datasheet; Price: 500 VND; Date of Price: 19/11/2010; Part: jumper selector

## Nets that join several sheets
3V3: 1. Power supply (C10.1 D4.2 R7.2 TP8.1), 2. MCU (L3.1), 4. ADC (R36.2 R41.2 R49.2)
3V3-LED: 2. MCU (R13.2 R14.2 SW2.1), 3.GSM Module (LED1.1)
4V3-LOAD: 1. Power supply (5 pins), 3.GSM Module (L5.1)
AGND: 2. MCU (U4.12), 4. ADC (20 pins)
GND: 1. Power supply (23 pins), 2. MCU (35 pins), 3.GSM Module (42 pins), 4. ADC (5 pins)
VBat: 1. Power supply (5 pins), 4. ADC (C4.1 R29.1)
GSM_ON: 2. MCU (U4.45), 3.GSM Module (R23.2)
GSM_RST: 2. MCU (U4.44), 3.GSM Module (Q4.1 R26.2)
NetC6_1: 1. Power supply (C6.1 D2.1 F1.1 TP1.1), 4. ADC (R32.1)
NetD7_2: 2. MCU (U4.8), 4. ADC (D7.2 R31.2)
NetD8_2: 2. MCU (U4.11), 4. ADC (D8.2 J6.2)
NetD9_2: 2. MCU (U4.9), 4. ADC (D9.2 R38.2)
NetD10_2: 2. MCU (U4.10), 4. ADC (D10.2 R45.2)
NetR19_2: 2. MCU (U4.43), 3.GSM Module (R19.2)
NetR20_2: 2. MCU (U4.42), 3.GSM Module (R20.2)
NetR29_2: 2. MCU (U4.33), 4. ADC (R29.2 R30.2)